# EAGLE design SparkFun_Serial_USB_Adapter-iPodNike (EAGLE 7.2.0)
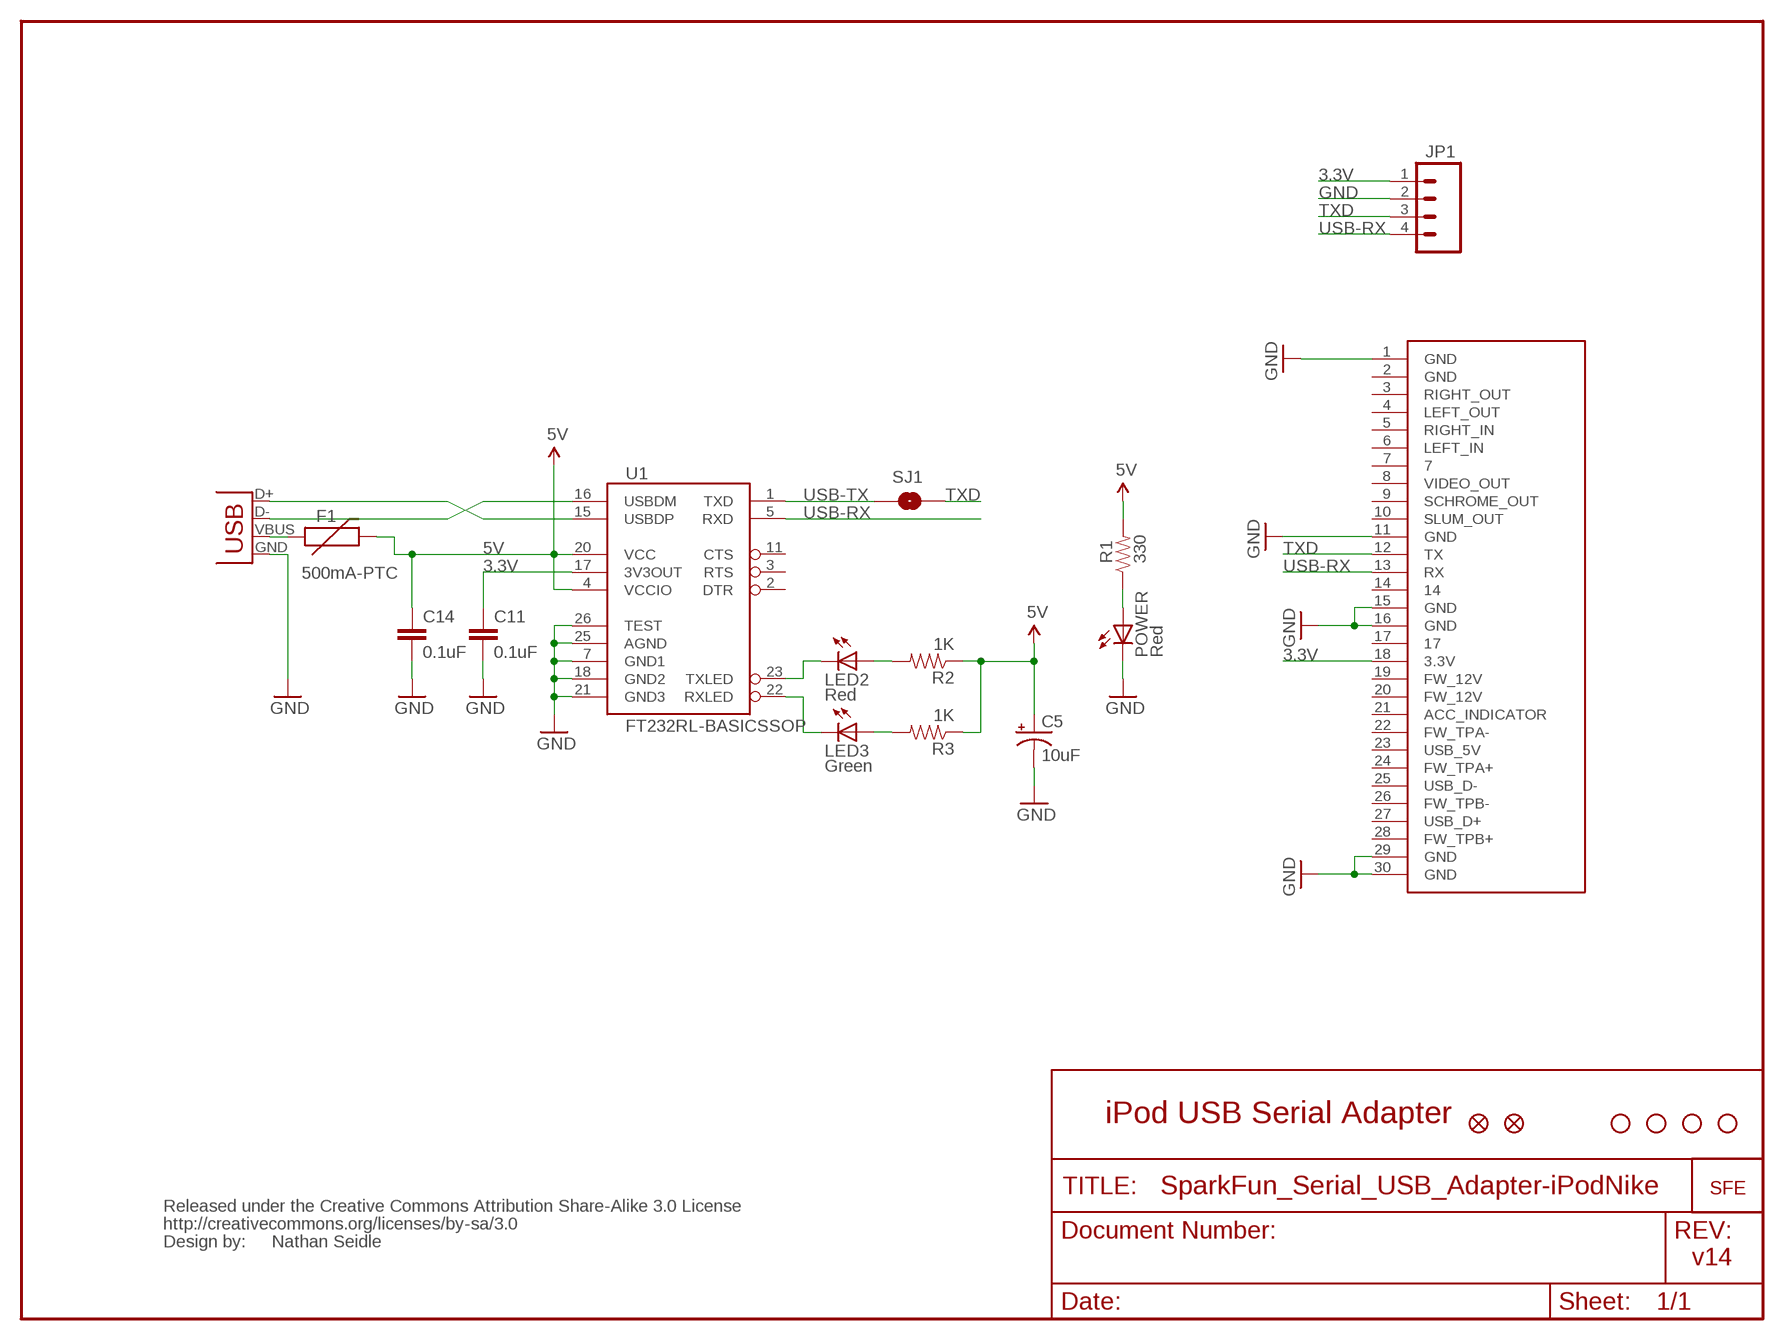
[diagram p0: schematic, sheet 1]

## Parts
C5  10uF  CAP_POL1206  [EIA3216]
C11  0.1uF  CAP0402  [C0402]
C14  0.1uF  CAP0402  [C0402]
F1  500mA-PTC  PTCSMD  [PTC-1206]
JP1  M04PTH  [1X04]
LED2  Red  LED0603  [LED-0603]
LED3  Green  LED0603  [LED-0603]
POWER  Red  LED0603  [LED-0603]
R1  330  RESISTOR0402  [C0402]
R2  1K  RESISTOR0402  [C0402]
R3  1K  RESISTOR0402  [C0402]
SJ1  SOLDERJUMPERNC2  [SJ_2S]
U1  FT232RL-BASICSSOP  [SSOP28DB]
U$1  STAND-OFF  [STAND-OFF]
U$2  IPOD_CONNECTOR_FEMALE  [IPOD_FEMALE_CONNECTOR]
U$3  LOGO-SFENEW  [SFE-NEW-WEBLOGO]
U$4  FIDUCIAL1X2  [FIDUCIAL-1X2]
U$5  STAND-OFF  [STAND-OFF]
U$6  STAND-OFF  [STAND-OFF]
U$7  STAND-OFF  [STAND-OFF]
U$8  FIDUCIAL1X2  [FIDUCIAL-1X2]
U$9  CREATIVE_COMMONS  [CREATIVE_COMMONS]
X1  USBSMD  [USB-MINIB]

## Nets
3.3V [vcc]: C11.1 JP1.1 U1.17(3V3OUT) U$2.18(3.3V)
5V [vcc]: C5.A(+) C14.1 F1.2 R1.2 R2.1 R3.1 U1.4(VCCIO) U1.20(VCC)
GND [vcc]: C5.C(-) C11.2 C14.2 JP1.2 POWER.C U1.7(GND1) U1.18(GND2) U1.21(GND3) U1.25(AGND) U1.26(TEST) U$2.1(GND) U$2.11(GND) U$2.15(GND) U$2.16(GND) U$2.29(GND) U$2.30(GND) X1.GND
N$1: POWER.A R1.1
N$2: U1.15(USBDP) X1.D+
N$3: LED2.A R2.2
N$4: LED3.A R3.2
N$6: U1.16(USBDM) X1.D-
RXLED: LED3.C U1.22(RXLED)
TXD: JP1.3 SJ1.2 U$2.12(TX)
TXLED: LED2.C U1.23(TXLED)
USB-RX: JP1.4 U1.5(RXD) U$2.13(RX)
USB-TX: SJ1.1 U1.1(TXD)
USBVCC [vcc]: F1.1 X1.VBUS
Unconnected: U1.2(DTR) U1.3(RTS) U1.11(CTS) U$2.2(GND) U$2.3(RIGHT_OUT) U$2.4(LEFT_OUT) U$2.5(RIGHT_IN) U$2.6(LEFT_IN) U$2.7 U$2.8(VIDEO_OUT) U$2.9(SCHROME_OUT) U$2.10(SLUM_OUT) U$2.14 U$2.17 U$2.19(FW_12V) U$2.20(FW_12V) U$2.21(ACC_INDICATOR) U$2.22(FW_TPA-) U$2.23(USB_5V) U$2.24(FW_TPA+) U$2.25(USB_D-) U$2.26(FW_TPB-) U$2.27(USB_D+) U$2.28(FW_TPB+)

## Notes on the sheet
- iPod USB Serial Adapter
- Nathan Seidle
- v14

## Library data of the parts
C5 = SparkFun:CAP_POL: Capacitor Polarized These are standard SMD and PTH capacitors. Normally 10uF, 47uF, and 100uF in electrolytic and tantalum varieties. Always verify the external diameter of the through hole cap, it varies with capacity, voltage, and manufacturer. The EIA devices should be standard.
C11 C14 = SparkFun:CAP: Capacitor Standard 0603 ceramic capacitor, and 0.1" leaded capacitor.
F1 = SparkFun:PTC: Resettable Fuse PTC Resettable Fuse. Spark Fun Electronics SKU : COM-08357
JP1 = SparkFun:M04: Header 4 Standard 4-pin 0.1" header. Use with straight break away headers (SKU : PRT-00116), right angle break away headers (PRT-00553), swiss pins (PRT-00743), machine pins (PRT-00117), and female headers (PRT-00115). Molex polarized connector foot print use with SKU : PRT-08231 with associated crimp pins and housings.
LED2 LED3 POWER = SparkFun:LED: LEDs Standard schematic elements and footprints for 5mm, 3mm, 1206, and 0603 sized LEDs. 5mm - Spark Fun Electronics SKU : COM-00529 (and others)
R1-R3 = SparkFun:RESISTOR: Resistor Basic schematic elements and footprints for 0603, 1206, and PTH 1/10th watt (small) resistors.
SJ1 = SparkFun:SOLDERJUMPER: Solder Jumper Standard SMD solder jumper. Used to automate production. Two varients : Normally Open and Normally Closed are the same, but have different paste layers. NC will have a large amount of paste and should jumper during reflow.
U1 = SparkFun:FT232RL-BASIC: USB UART This is the simplified version of the FT232RL unit. Only what you need, nothing you don't. Spark Fun Electronics SKU : COM-00650
U$1 U$5-U$7 = SparkFun:STAND-OFF: Stand Off This is the mechanical footprint for a #4 phillips button head screw. Use the keepout ring to avoid running the screw head into surrounding components. SKU : PRT-00447
U$2 = SparkFun:IPOD_CONNECTOR_FEMALE: iPod Female Connector This is the connector found inside current iPods. Use this connector to attach to iPod accessories like Nike+iPods, etc. Schematic and footprint are not yet production proven. Spark Fun Electronics SKU : DEV-08035
U$3 = SparkFun:LOGO-SFE: Spark Fun Electronics PCB Logo This is the standard Spark Fun Electronics PCB logo.
U$4 U$8 = SparkFun:FIDUCIAL: Fiducial Alignment Points Various fiducial points for machine vision alignment.
U$9 = SparkFun:CREATIVE_COMMONS
X1 = SparkFun:USB: USB Connectors USB-B-PTH is fully proven SKU : PRT-00139 USB-miniB is fully proven SKU : PRT-00587 USB-A-PCB is untested. USB-A-H is throughly reviewed, but untested. Spark Fun Electronics SKU : PRT-00437 USB-B-SMT is throughly reviewed, but untested. Needs silkscreen touching up. USB-A-S has not been used/tested USB-MB-H has not been used/tested

## Net classes
0 default: width 0.203 mm
1 vcc: width 0.203 mm

## Board
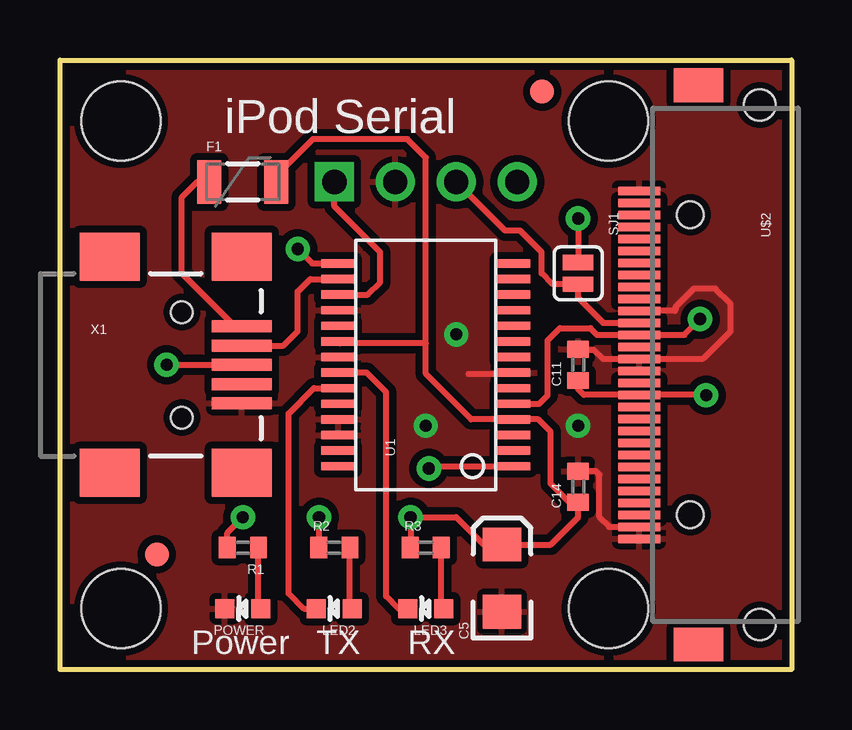
[diagram p1: board, top side]
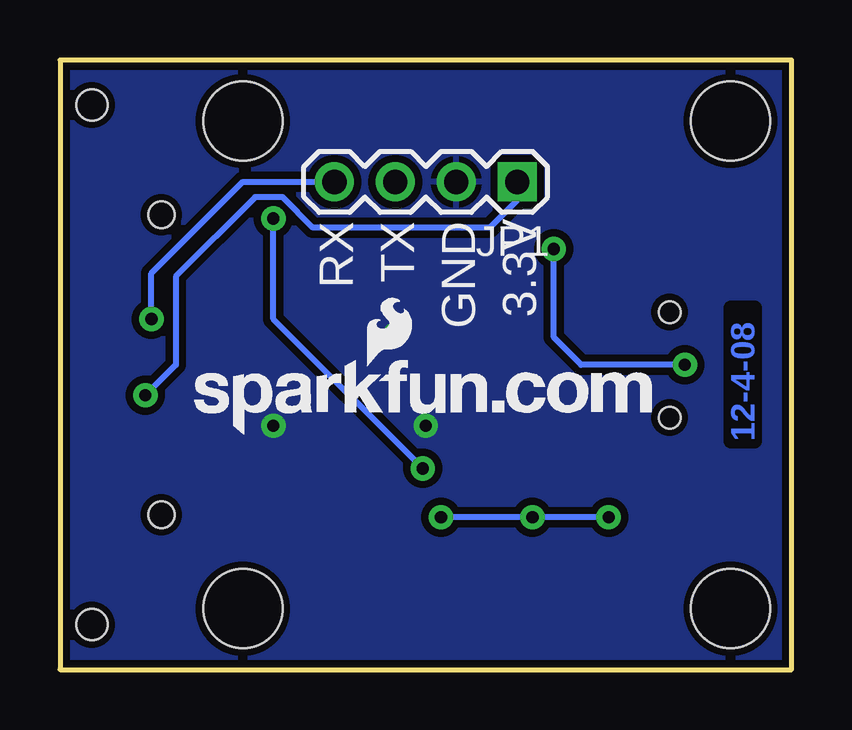
[diagram p2: board, bottom side, seen from below]

Size 30.48 x 25.4 mm. Coordinates in mm from the lower left corner, seen from the top.
Outline: 0,25.4 30.48,25.4 30.48,0 0,0 0,25.4
Copper layers (1*16): Top 0.035mm / dielectric 1.5mm / Bottom 0.035mm
Design rules "SparkFun *": minimum track width 8mil, minimum drill 20mil, track to track 8mil, track to pad 8mil, pad to pad 8mil, via to via 8mil, smd to smd 8mil, copper to edge 10mil, drill to drill 8mil, minimum pad ring 12mil, minimum via ring 10mil, stop-mask expansion 4mil, vias tented up to drill 25mil, thermal gap 10mil

### Footprints (pad centres in the part's own frame; a part is rotated, then mirrored left to right if it is on the bottom)
EIA3216 = smd 1.4 x 1.6: A 1.4,0; C -1.4,0
C0402 = smd 0.7 x 0.9: 1 -0.65,0; 2 0.65,0
PTC-1206 = smd 1 x 1.8: 1 -1.4,0; 2 1.4,0
1X04 = drill 1.016 square: 1 0,0 | drill 1.016: 2 2.54,0; 3 5.08,0; 4 7.62,0
LED-0603 = smd 0.8 x 0.8: A 0,-0.75; C 0,0.75
SJ_2S = smd 0.635 x 1.27: 1 -0.45,0; 2 0.45,0
SSOP28DB = smd 0.348 x 1.397: 1 -4.225,-3.656; 2 -3.575,-3.656; 3 -2.925,-3.656; 4 -2.275,-3.656; 5 -1.625,-3.656; 6 -0.975,-3.656; 7 -0.325,-3.656; 8 0.325,-3.656; 9 0.975,-3.656; 10 1.625,-3.656; 11 2.275,-3.656; 12 2.925,-3.656; 13 3.575,-3.656; 14 4.225,-3.656; 15 4.225,3.656; 16 3.575,3.656; 17 2.925,3.656; 18 2.275,3.656; 19 1.625,3.656; 20 0.975,3.656; 21 0.325,3.656; 22 -0.325,3.656; 23 -0.975,3.656; 24 -1.625,3.656; 25 -2.275,3.656; 26 -2.925,3.656; 27 -3.575,3.656; 28 -4.225,3.656
STAND-OFF = hole 3.302: 0,0
IPOD_FEMALE_CONNECTOR = smd 0.35 x 1.75: 1 -7.25,0; 2 -6.75,0; 3 -6.25,0; 4 -5.75,0; 5 -5.25,0; 6 -4.75,0; 7 -4.25,0; 8 -3.75,0; 9 -3.25,0; 10 -2.75,0; 11 -2.25,0; 12 -1.75,0; 13 -1.25,0; 14 -0.75,0; 15 -0.25,0; 16 0.25,0; 17 0.75,0; 18 1.25,0; 19 1.75,0; 20 2.25,0; 21 2.75,0; 22 3.25,0; 23 3.75,0; 24 4.25,0; 25 4.75,0; 26 5.25,0; 27 5.75,0; 28 6.25,0; 29 6.75,0; 30 7.25,0 | smd 1.4 x 2.05: 31 -11.65,2.475; 32 11.65,2.475 | hole 1.1: 6.25,2.125; -6.25,2.125 | hole 1.3: 10.825,5.025; -10.825,5.025
FIDUCIAL-1X2 = smd 1 x 1: 1 0,0
USB-MINIB = smd 2.5 x 0.5: D+ 2.5,0; D- 2.5,0.8; GND 2.5,-1.6; ID 2.5,-0.8; VBUS 2.5,1.6 | smd 2.5 x 2: GND@1 -3,-4.5; GND@2 -3,4.5; GND@3 2.5,4.5; GND@4 2.5,-4.5 | hole 0.9: 0,2.2; 0,-2.2

### Placement (x,y rotation side)
C5  18.41,3.81 90 top
C11  21.59,12.7 90 top
C14  21.59,7.62 90 top
F1  7.62,20.32 0 top
JP1  11.43,20.32 180 bottom
LED2  11.43,2.54 90 top
LED3  15.24,2.54 90 top
POWER  7.62,2.54 90 top
R1  7.62,5.08 180 top
R2  11.43,5.08 0 top
R3  15.24,5.08 0 top
SJ1  21.59,16.51 270 top
U1  15.24,12.7 90 top
U$1  2.54,22.86 0 top
U$2  24.13,12.7 270 top
U$3  24.89,9.78 0 bottom
U$4  4.04,4.8 0 top
U$5  22.86,22.86 0 top
U$6  2.54,2.54 0 top
U$7  22.86,2.54 0 top
U$8  20.09,24.08 0 top
U$9  20.32,-8.89 0 top  (outside the outline)
X1  5.08,12.7 0 top

### Tracks (layer width: path | path; a pad name or v marks a point on that pad's centre or on a via)
3.3V  (via drill 0.51)
  Top 0.254: JP1.1 11.43,19.3 13.34,17.4 13.34,16.13 12.83,15.62 U1.17 | C11.1 21.59,11.68 21.82,11.45 U$2.18 26.9,11.45 v26.92,11.43
  Bottom 0.254: JP1.1 11.43,19.56 12.57,18.41 19.94,18.41 21.21,19.68 22.35,19.68 25.65,16.38 25.65,12.7 v26.92,11.43
5V  (via drill 0.51)
  Top 0.254: F1.2 9.02,20.58 10.54,22.1 14.48,22.1 15.24,21.34 15.24,13.59 | R1.2 6.97,5.7 v7.62,6.35 | R3.1 14.61,5.08 v14.61,6.35 16.51,6.35 17.65,5.21 C5.A 20.45,5.21 21.59,6.35 C14.1 21.22,6.97 20.45,7.75 20.45,9.91 19.94,10.41 19.93,10.43 U1.4 17.13,10.43 15.24,12.32 15.24,13.59 | R2.1 10.78,6.33 v10.79,6.35 | U1.20 11.67,13.59 15.24,13.59
  Bottom 0.254: v7.62,6.35 v10.79,6.35 v14.61,6.35
GND  (via drill 0.51)
  Top 0.254: C14.2 21.61,8.26 22.35,8.26 22.48,8.13 22.48,6.35 22.88,5.95 U$2.29 | U$2.15 | U$2.15 22.61,12.95 22.23,13.34 21.59,13.34 C11.2 | U1.7 18.84,12.32 17.02,12.32 | U$2.11 25.62,14.95 25.65,14.99 25.65,15.11 26.42,15.88 27.3,15.88 27.94,15.24 27.94,14.1 26.8,12.95 U$2.15
  other vias: 21.59,10.16 16.51,13.97 15.24,10.16
  pour Top (isolate 0.305): 0,0 0,25.4 30.48,25.4 30.48,0
  pour Bottom (isolate 0.305): 0,0 0,25.4 30.48,25.4 30.48,0
N$1
  Top 0.254: POWER.A 8.38,2.54 8.27,2.65 R1.1
N$2  (via drill 0.51)
  Top 0.254: v4.45,12.7 X1.D+ | U1.15 10.51,16.93 v9.91,17.53
  Bottom 0.254: v4.45,12.7 8.76,12.7 9.91,13.84 v9.91,17.53
N$3
  Top 0.254: LED2.A 12.19,2.54 12.08,2.65 R2.2
N$4
  Top 0.254: LED3.A 16,2.54 15.89,2.65 R3.2
N$6
  Top 0.254: X1.D- 9.31,13.5 9.91,14.1 9.91,15.75 10.43,16.27 U1.16
RXLED
  Top 0.254: LED3.C 14.1,2.54 13.59,3.05 13.59,11.56 12.77,12.38 U1.22
TXD
  Top 0.254: JP1.3 18.54,18.29 19.18,18.29 20.07,17.4 20.07,16.51 20.52,16.06 SJ1.2 21.59,15.49 22.63,14.45 U$2.12
TXLED
  Top 0.254: LED2.C 10.16,2.54 9.53,3.17 9.53,10.67 10.58,11.72 U1.23
USB-RX  (via drill 0.51)
  Top 0.254: U1.5 19.96,11.07 20.32,11.43 20.32,13.72 20.83,14.22 22.1,14.22 22.37,13.95 U$2.13 26.02,13.95 v26.67,14.61
  Bottom 0.254: JP1.4 22.86,20.32 26.67,16.51 v26.67,14.61
USB-TX  (via drill 0.51)
  Top 0.254: v21.59,18.8 SJ1.1 | U1.1 15.46,8.47 v15.37,8.38
  Bottom 0.254: v21.59,18.8 21.59,14.61 v15.37,8.38
USBVCC
  Top 0.254: X1.VBUS 7.29,14.3 5.08,16.51 5.08,19.68 5.71,20.32 F1.1 6.35,20.32

### Text on the board
Bottom: 12-4-08
tPlace: iPod Serial | Power | TX | RX
bPlace: 3.3V | GND | TX | RX